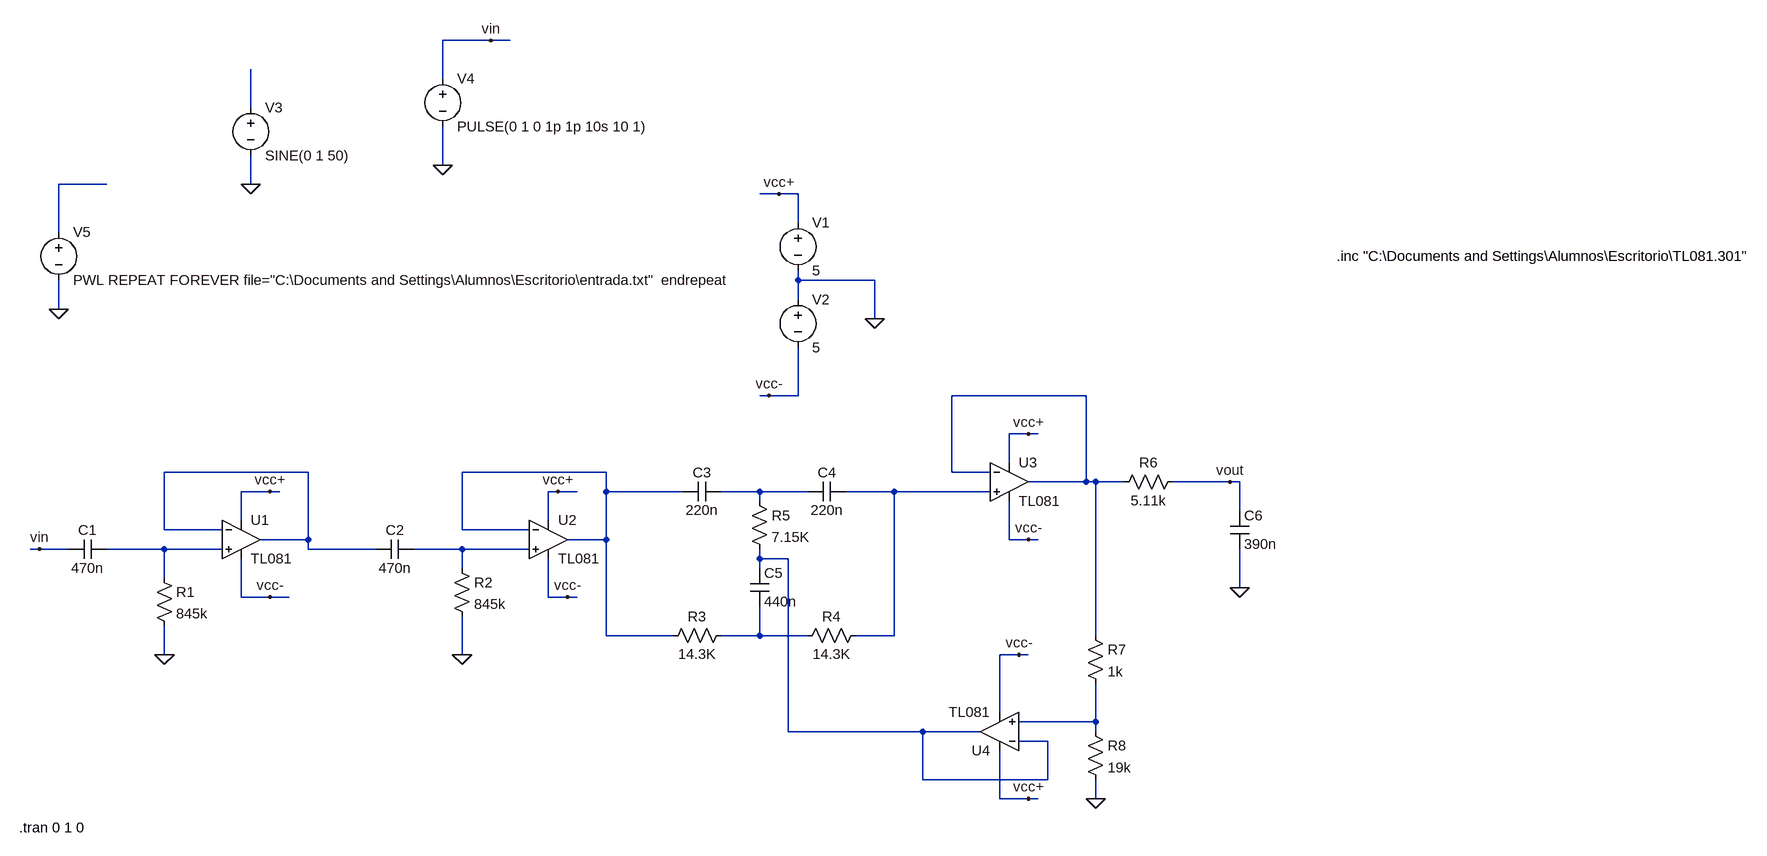
[diagram p0: schematic tpadc.asc]
tpadc.asc, the LTspice schematic file:
Version 4
SHEET 1 2040 1104
WIRE -672 -224 -752 -224
WIRE -640 -224 -672 -224
WIRE -752 -160 -752 -224
WIRE -1072 -112 -1072 -176
WIRE -752 -16 -752 -80
WIRE -1312 16 -1392 16
WIRE -1072 16 -1072 -32
WIRE -192 32 -224 32
WIRE -160 32 -192 32
WIRE -160 80 -160 32
WIRE -1392 96 -1392 16
WIRE -160 176 -160 160
WIRE -32 176 -160 176
WIRE -160 208 -160 176
WIRE -1392 224 -1392 176
WIRE -32 240 -32 176
WIRE -208 368 -224 368
WIRE -160 368 -160 288
WIRE -160 368 -208 368
WIRE 320 368 96 368
WIRE 224 432 192 432
WIRE 240 432 224 432
WIRE 192 480 192 432
WIRE -976 496 -1216 496
WIRE -480 496 -720 496
WIRE 96 496 96 368
WIRE 160 496 96 496
WIRE 320 512 320 368
WIRE 320 512 224 512
WIRE 336 512 320 512
WIRE 384 512 336 512
WIRE 560 512 464 512
WIRE 576 512 560 512
WIRE -1040 528 -1088 528
WIRE -1024 528 -1040 528
WIRE -560 528 -576 528
WIRE -528 528 -560 528
WIRE -480 528 -480 496
WIRE -352 528 -480 528
WIRE -224 528 -288 528
WIRE -144 528 -224 528
WIRE 0 528 -80 528
WIRE 160 528 0 528
WIRE -224 544 -224 528
WIRE 576 560 576 512
WIRE -1088 576 -1088 528
WIRE -576 576 -576 528
WIRE -1216 592 -1216 496
WIRE -1120 592 -1216 592
WIRE -720 592 -720 496
WIRE -608 592 -720 592
WIRE -976 608 -976 496
WIRE -976 608 -1056 608
WIRE -480 608 -480 528
WIRE -480 608 -544 608
WIRE 192 608 192 544
WIRE 224 608 192 608
WIRE 240 608 224 608
WIRE -1424 624 -1440 624
WIRE -1376 624 -1424 624
WIRE -1216 624 -1312 624
WIRE -1120 624 -1216 624
WIRE -976 624 -976 608
WIRE -864 624 -976 624
WIRE -720 624 -800 624
WIRE -608 624 -720 624
WIRE -224 640 -224 624
WIRE -176 640 -224 640
WIRE -720 656 -720 624
WIRE -224 656 -224 640
WIRE -1216 672 -1216 624
WIRE 576 688 576 624
WIRE -1088 704 -1088 640
WIRE -1040 704 -1088 704
WIRE -1008 704 -1040 704
WIRE -576 704 -576 640
WIRE -544 704 -576 704
WIRE -528 704 -544 704
WIRE -480 768 -480 608
WIRE -368 768 -480 768
WIRE -224 768 -224 720
WIRE -224 768 -288 768
WIRE -144 768 -224 768
WIRE 0 768 0 528
WIRE 0 768 -64 768
WIRE 336 768 336 512
WIRE -1216 800 -1216 752
WIRE -720 800 -720 736
WIRE 208 800 176 800
WIRE 224 800 208 800
WIRE 176 896 176 800
WIRE 336 912 336 848
WIRE 336 912 208 912
WIRE -176 928 -176 640
WIRE 48 928 -176 928
WIRE 144 928 48 928
WIRE 336 928 336 912
WIRE 256 944 208 944
WIRE 48 1008 48 928
WIRE 256 1008 256 944
WIRE 256 1008 48 1008
WIRE 176 1040 176 960
WIRE 224 1040 176 1040
WIRE 240 1040 224 1040
WIRE 336 1040 336 1008
FLAG 576 688 0
FLAG 336 1040 0
FLAG -1216 800 0
FLAG -720 800 0
FLAG -1040 528 vcc+
FLAG -560 528 vcc+
FLAG 224 1040 vcc+
FLAG 224 432 vcc+
FLAG -1040 704 vcc-
FLAG -544 704 vcc-
FLAG 208 800 vcc-
FLAG 224 608 vcc-
FLAG -32 240 0
FLAG -192 32 vcc+
FLAG -208 368 vcc-
FLAG -1424 624 vin
FLAG 560 512 vout
FLAG -1072 16 0
FLAG -752 -16 0
FLAG -1392 224 0
FLAG -672 -224 vin
SYMBOL Opamps\\opamp2 -1088 544 R0
SYMATTR InstName U1
SYMATTR Value TL081
SYMBOL Opamps\\opamp2 -576 544 R0
SYMATTR InstName U2
SYMATTR Value TL081
SYMBOL cap -1312 608 R90
WINDOW 0 0 32 VBottom 2
WINDOW 3 32 32 VTop 2
SYMATTR InstName C1
SYMATTR Value 470n
SYMBOL res -1232 656 R0
SYMATTR InstName R1
SYMATTR Value 845k
SYMBOL res -736 640 R0
SYMATTR InstName R2
SYMATTR Value 845k
SYMBOL cap -800 608 R90
WINDOW 0 0 32 VBottom 2
WINDOW 3 32 32 VTop 2
SYMATTR InstName C2
SYMATTR Value 470n
SYMBOL cap -288 512 R90
WINDOW 0 0 32 VBottom 2
WINDOW 3 32 32 VTop 2
SYMATTR InstName C3
SYMATTR Value 220n
SYMBOL cap -80 512 R90
WINDOW 0 0 32 VBottom 2
WINDOW 3 32 32 VTop 2
SYMATTR InstName C4
SYMATTR Value 220n
SYMBOL res -272 752 R90
WINDOW 0 0 56 VBottom 2
WINDOW 3 32 56 VTop 2
SYMATTR InstName R3
SYMATTR Value 14.3K
SYMBOL res -48 752 R90
WINDOW 0 0 56 VBottom 2
WINDOW 3 32 56 VTop 2
SYMATTR InstName R4
SYMATTR Value 14.3K
SYMBOL res -240 528 R0
SYMATTR InstName R5
SYMATTR Value 7.15K
SYMBOL cap -240 656 R0
SYMATTR InstName C5
SYMATTR Value 440n
SYMBOL Opamps\\opamp2 192 448 R0
SYMATTR InstName U3
SYMATTR Value TL081
SYMBOL Opamps\\opamp2 176 992 R180
SYMATTR InstName U4
SYMATTR Value TL081
SYMBOL res 480 496 R90
WINDOW 0 0 56 VBottom 2
WINDOW 3 32 56 VTop 2
SYMATTR InstName R6
SYMATTR Value 5.11k
SYMBOL cap 560 560 R0
SYMATTR InstName C6
SYMATTR Value 390n
SYMBOL res 320 752 R0
SYMATTR InstName R7
SYMATTR Value 1k
SYMBOL res 320 912 R0
SYMATTR InstName R8
SYMATTR Value 19k
SYMBOL voltage -160 64 R0
WINDOW 123 0 0 Left 2
WINDOW 39 0 0 Left 2
SYMATTR InstName V1
SYMATTR Value 5
SYMBOL voltage -160 192 R0
WINDOW 123 0 0 Left 2
WINDOW 39 0 0 Left 2
SYMATTR InstName V2
SYMATTR Value 5
SYMBOL voltage -1072 -128 R0
WINDOW 123 0 0 Left 2
WINDOW 39 0 0 Left 2
SYMATTR InstName V3
SYMATTR Value SINE(0 1 50)
SYMBOL voltage -1392 80 R0
WINDOW 123 0 0 Left 2
WINDOW 39 0 0 Left 2
SYMATTR InstName V5
SYMATTR Value PWL REPEAT FOREVER file="C:\Documents and Settings\Alumnos\Escritorio\entrada.txt"  endrepeat
SYMBOL voltage -752 -176 R0
WINDOW 123 0 0 Left 2
WINDOW 39 0 0 Left 2
SYMATTR InstName V4
SYMATTR Value PULSE(0 1 0 1p 1p 10s 10 1)
TEXT 1208 136 Left 2 !.inc "C:\\Documents and Settings\\Alumnos\\Escritorio\\TL081.301"
TEXT -1458 1088 Left 2 !.tran 0 1 0

The netlist it stands for:
* tpadc.asc
XU1 N008 N004 vcc+ vcc- N004 TL081  ; pins In+ In- V+ V- OUT
XU2 N009 N005 vcc+ vcc- N005 TL081  ; pins In+ In- V+ V- OUT
C1 N008 vin 470n
R1 N008 0 845k
R2 N009 0 845k
C2 N009 N004 470n
C3 N006 N005 220n
C4 N007 N006 220n
R3 N011 N005 14.3K
R4 N007 N011 14.3K
R5 N006 N010 7.15K
C5 N010 N011 440n
XU3 N007 N003 vcc+ vcc- N003 TL081  ; pins In+ In- V+ V- OUT
XU4 N012 N010 vcc+ vcc- N010 TL081  ; pins In+ In- V+ V- OUT
R6 vout N003 5.11k
C6 vout 0 390n
R7 N003 N012 1k
R8 N012 0 19k
V1 vcc+ 0 5
V2 0 vcc- 5
V3 N001 0 SINE(0 1 50)
V5 N002 0 PWL REPEAT FOREVER file="C:\Documents and Settings\Alumnos\Escritorio\entrada.txt"  endrepeat
V4 vin 0 PULSE(0 1 0 1p 1p 10s 10 1)
.inc "C:\Documents and Settings\Alumnos\Escritorio\TL081.301"
.tran 0 1 0
.backanno
.end